# Altium schematic sheet Top.SchDoc: USBC Hub
size 431 x 279 mm; Author: Eric Liu; SheetNumber: 1; SheetTotal: 6
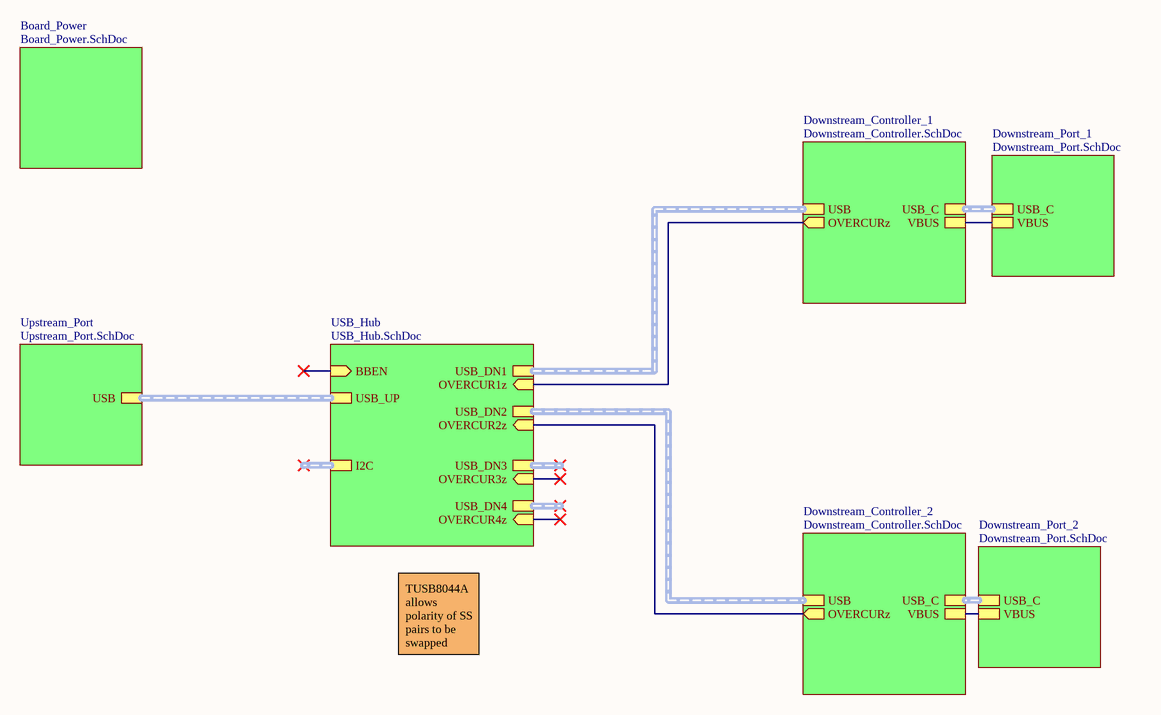
[diagram p0: Top.SchDoc]

## Sub-sheets
Board_Power = Board_Power.SchDoc: no entries
Downstream_Controller_1 = Downstream_Controller.SchDoc: USB (harness USB), OVERCURz (out), USB_C (harness USB_C), VBUS
Downstream_Controller_2 = Downstream_Controller.SchDoc: USB (harness USB), OVERCURz (out), USB_C (harness USB_C), VBUS
Downstream_Port_1 = Downstream_Port.SchDoc: USB_C (harness USB_C), VBUS
Downstream_Port_2 = Downstream_Port.SchDoc: USB_C (harness USB_C), VBUS
Upstream_Port = Upstream_Port.SchDoc: USB (harness USB)
USB_Hub = USB_Hub.SchDoc: I2C (harness USB), USB_UP (harness USB), USB_DN1 (harness USB), USB_DN2 (harness USB), USB_DN3 (harness USB), USB_DN4 (harness USB), OVERCUR1z (in), OVERCUR2z (in), OVERCUR3z (in), OVERCUR4z (in), BBEN (in)

## Nets
(unnamed): sheet Downstream_Controller_1/OVERCURz, sheet USB_Hub/OVERCUR1z
(unnamed): sheet Downstream_Controller_1/VBUS, sheet Downstream_Port_1/VBUS
(unnamed): sheet USB_Hub/OVERCUR2z, sheet Downstream_Controller_2/OVERCURz
(unnamed): sheet Downstream_Controller_2/VBUS, sheet Downstream_Port_2/VBUS

## Buses and harness runs
harness sheet Downstream_Controller_1/USB = sheet USB_Hub/USB_DN1
harness sheet Downstream_Controller_1/USB_C = sheet Downstream_Port_1/USB_C
harness sheet Downstream_Controller_2/USB = sheet USB_Hub/USB_DN2
harness sheet Downstream_Controller_2/USB_C = sheet Downstream_Port_2/USB_C
harness sheet Upstream_Port/USB = sheet USB_Hub/USB_UP

## Notes on the sheet
- TUSB8044A allows polarity of SS pairs to be swapped
- DWG. NO.
- REV.
- SHT.
- THIS DOCUMENT AND THE DATA DISCLOSED HEREIN OR HEREWITH IS THE PROPERTY OF ALTIUM LIMITED AND MAY BE FREELY DISTRIBUTED IN WHOLE. NO RIGHTS ARE RESERVED OR EXPRESS OR IMPLIED WARANTEE GIVEN.
- REVISION
- DESCRIPTION
- DATE
- APPROVED
- ENG:
- APPROVALS
- PROJECT
- DSN:
- CHK:
- REFERENCE DOCUMENTS
- PROJECT REVISION:
- TITLE
- DOCUMENT REVISION:
- DESIGN ITEM:
- BOM:
- FAB DWG:
- PCB DWG:
- ASSY DWG:
- SCALE:
- SIZE
- B
- CAGE CODE
- FILE NAME
- DWG NO.
- SHEET
- OF
- REV